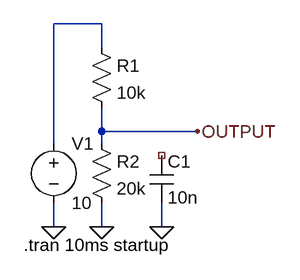
[diagram p0: schematic Draft1.asc]
Draft1.asc, the LTspice schematic file:
Version 4.1
SHEET 1 880 680
WIRE 160 -32 96 -32
WIRE 160 0 160 -32
WIRE 160 112 160 80
WIRE 288 112 160 112
WIRE 96 128 96 -32
WIRE 160 128 160 112
WIRE 96 240 96 208
WIRE 160 240 160 208
WIRE 240 240 240 208
FLAG 96 240 0
FLAG 160 240 0
FLAG 288 112 OUTPUT
FLAG 240 240 0
SYMBOL voltage 96 112 R0
WINDOW 123 0 0 Left 0
WINDOW 39 0 0 Left 0
SYMATTR InstName V1
SYMATTR Value 10
SYMBOL res 144 -16 R0
SYMATTR InstName R1
SYMATTR Value 10k
SYMBOL res 144 112 R0
SYMATTR InstName R2
SYMATTR Value 20k
SYMBOL cap 224 144 R0
SYMATTR InstName C1
SYMATTR Value 10n
TEXT 56 264 Left 2 !.tran 10ms startup

The netlist it stands for:
* Draft1.asc
V1 N001 0 10
R1 N001 OUTPUT 10k
R2 OUTPUT 0 20k
C1 NC_01 0 10n
.tran 10ms startup
.backanno
.end